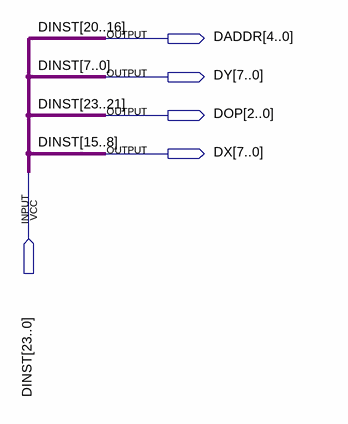
[diagram p0: schematic sheet]
// Quartus schematic Decoder.bdf as structural Verilog: 0 symbols, 5 pins
module Decoder (
  input  [23:0] DINST,
  output [4:0] DADDR,
  output [7:0] DY,
  output [2:0] DOP,
  output [7:0] DX
);


  assign DADDR = DINST[20:16];
  assign DOP = DINST[23:21];
  assign DX = DINST[15:8];
  assign DY = DINST[7:0];
endmodule
